# EAGLE design Single-Phase-Energy-Meter_v1.4-rev1 (EAGLE 9.4.2)
CNAME: Single Phase Energy Meter; CREVISION: 2; DESIGNER: John deGlavina
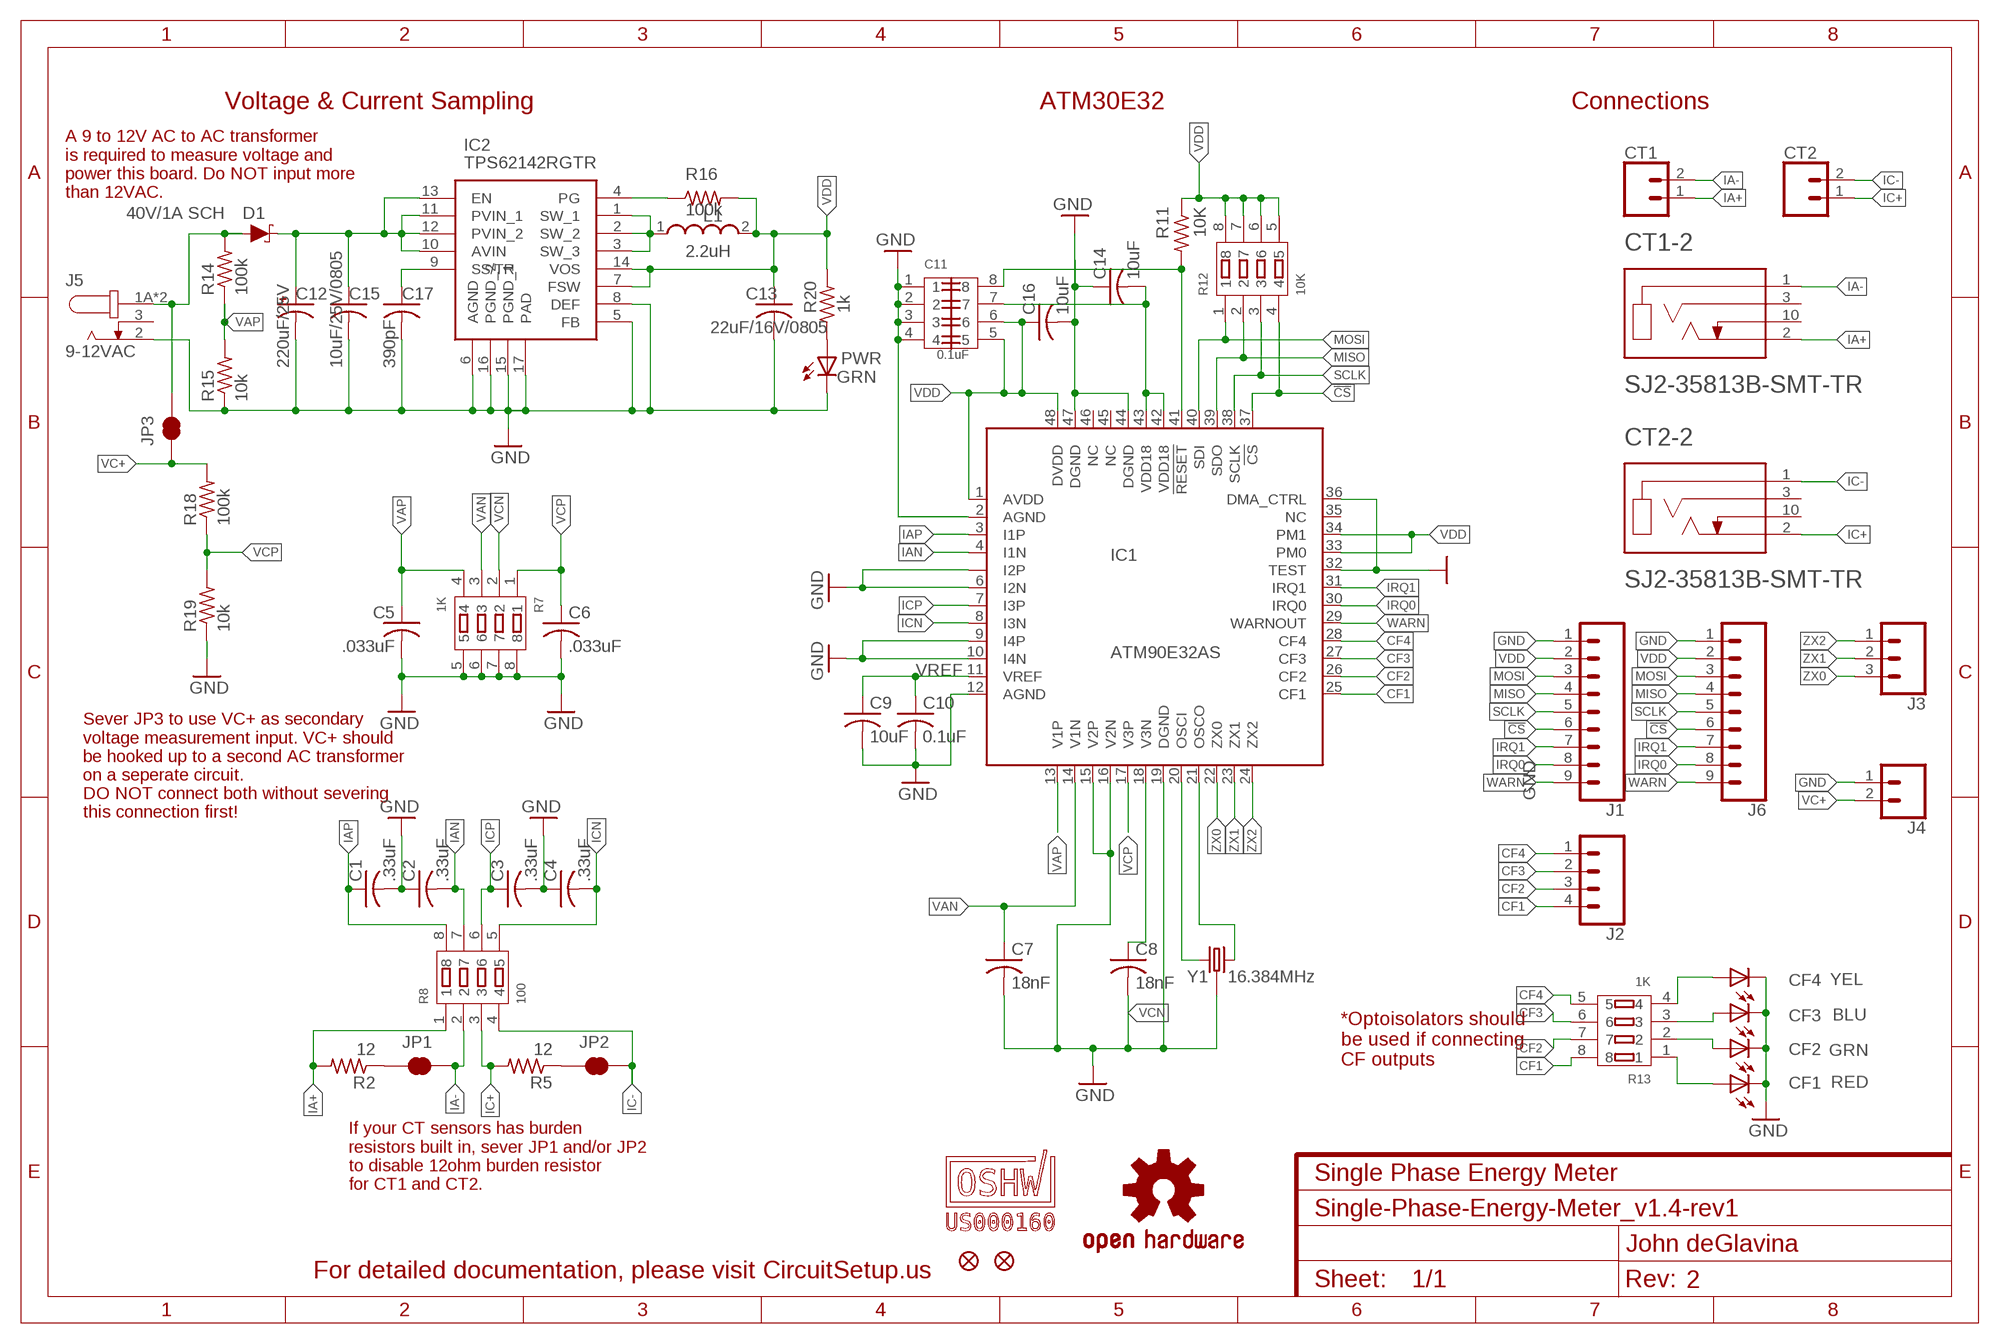
[diagram p0: schematic, sheet 1]

## Parts
C1  .33uF  C-USC0603  [C0603]
C2  .33uF  C-USC0603  [C0603]
C3  .33uF  C-USC0603  [C0603]
C4  .33uF  C-USC0603  [C0603]
C5  .033uF  C-USC0603  [C0603]
C6  .033uF  C-USC0603  [C0603]
C7  18nF  C-USC0603  [C0603]
C8  18nF  C-USC0603  [C0603]
C9  10uF  C-USC0603  [C0603]
C10  0.1uF  C-USC0603  [C0603]
C11  0.1uF  CAP-ARRAY4  [CAPCAF80P320X160X70-8]
C12  220uF/25V  CPOL-US153CLV-0605  [153CLV-0605]
C13  22uF/16V/0805  C-USC0805  [C0805]
C14  10uF  C-USC0603  [C0603]
C15  10uF/25V/0805  C-USC0805  [C0805]
C16  10uF  C-USC0603  [C0603]
C17  390pF  C-USC0603  [C0603]
CF1  RED  LEDCHIP-LED0603  [CHIP-LED0603]
CF2  GRN  LEDCHIP-LED0603  [CHIP-LED0603]
CF3  BLU  LEDCHIP-LED0603  [CHIP-LED0603]
CF4  YEL  LEDCHIP-LED0603  [CHIP-LED0603]
CT1  CONN_023.5MM  [SCREWTERMINAL-3.5MM-2]
CT1-2  SJ2-35813B-SMT-TR  [CUI_SJ2-35813B-SMT-TR]
CT2  CONN_023.5MM  [SCREWTERMINAL-3.5MM-2]
CT2-2  SJ2-35813B-SMT-TR  [CUI_SJ2-35813B-SMT-TR]
D1  40V/1A SCH  DIODE-SCHOTTKY-SS14  [SMA-DIODE]
FD1  FIDUCIALUFIDUCIAL  [FIDUCIAL-MICRO]
FD2  FIDUCIALUFIDUCIAL  [FIDUCIAL-MICRO]
IC1  ATM90E32AS  ATM90E36  [QFP50P900X900X120-48N]
IC2  TPS62142RGTR  [QFN50P300X300X100-17N]
J1  CONN_09  [1X09]
J2  CONN_04  [1X04]
J3  CONN_03  [1X03]
J4  CONN_02  [1X02]
J5  9-12VAC  PJ-002AH-SMT-TR  [CUI_PJ-002AH-SMT-TR]
J6  CONN_09  [1X09]
JP1  JUMPER-SMT_2_NC_TRACE_SILK  [SMT-JUMPER_2_NC_TRACE_SILK]
JP2  JUMPER-SMT_2_NC_TRACE_SILK  [SMT-JUMPER_2_NC_TRACE_SILK]
JP3  JUMPER-SMT_2_NC_TRACE_SILK  [SMT-JUMPER_2_NC_TRACE_SILK]
L1  2.2uH  PA4332.222NLT  [INDPM4042X200N]
LOGO1  OSHW-LOGOS  [OSHW-LOGO-S]
PWR  GRN  LEDCHIP-LED0603  [CHIP-LED0603]
R2  12  R-US_R0603  [R0603]
R5  12  R-US_R0603  [R0603]
R7  1K  SMD-RES-ARRAY-1K-4R(RA1206-8)  [RA1206-8]
R8  100  SMD-RES-ARRAY-1K-4R(RA1206-8)  [RA1206-8]
R11  10K  R-US_R0603  [R0603]
R12  10K  SMD-RES-ARRAY-1K-4R(RA1206-8)  [RA1206-8]
R13  1K  SMD-RES-ARRAY-1K-4R(RA1206-8)  [RA1206-8]
R14  100k  R-US_R0603  [R0603]
R15  10k  R-US_R0603  [R0603]
R16  100k  R-US_R0603  [R0603]
R18  100k  R-US_R0603  [R0603]
R19  10k  R-US_R0603  [R0603]
R20  1k  R-US_R0603  [R0603]
U$1  CS_OSHW_LOGOS  [OSHW160]
Y1  16.384MHz  CRYSTAL-GROUNDEDSMD-3.2X2.5  [CRYSTAL-SMD-3.2X2.5MM]

## Nets
!CS: IC1.37(!CS) J1.6 J6.6 R12.4
!RESET: C11.8 IC1.41(!RESET) R11.2
CF1: IC1.25(CF1) J2.4 R13.8
CF2: IC1.26(CF2) J2.3 R13.7
CF3: IC1.27(CF3) J2.2 R13.6
CF4: IC1.28(CF4) J2.1 R13.5
GND [pwr]: C1.2 C2.1 C3.2 C4.1 C5.2 C6.2 C7.2 C8.2 C9.2 C10.2 C11.1 C11.2 C11.3 C11.4 C12.- C13.2 C14.1 C15.2 C16.2 C17.2 CF1.C CF2.C CF3.C CF4.C IC1.2(AGND) IC1.5(I2P) IC1.6(I2N) IC1.9(I4P) IC1.10(I4N) IC1.12(AGND) IC1.15(V2P) IC1.16(V2N) IC1.19(DGND) IC1.32(TEST) IC1.36(DMA_CTRL) IC1.44(DGND) IC1.47(DGND) IC2.5(FB) IC2.6(AGND) IC2.8(DEF) IC2.15(PGND_1) IC2.16(PGND_2) IC2.17(PAD) J1.1 J4.1 J5.2 J6.1 PWR.C R7.5 R7.6 R7.7 R7.8 R15.1 R19.1 Y1.2 Y1.4
IA+ [analog]: CT1-2.2(TIP) CT1.1 R2.2 R8.1
IA- [analog]: CT1-2.1(SLEEVE) CT1.2 JP1.2 R8.2
IAN [analog]: C2.2 IC1.4(I1N) R8.7
IAP [analog]: C1.1 IC1.3(I1P) R8.8
IC+ [analog]: CT2-2.2(TIP) CT2.1 R5.2 R8.3
IC- [analog]: CT2-2.1(SLEEVE) CT2.2 JP2.2 R8.4
ICN [analog]: C4.2 IC1.8(I3N) R8.5
ICP [analog]: C3.1 IC1.7(I3P) R8.6
IRQ0: IC1.30(IRQ0) J1.8 J6.8
IRQ1: IC1.31(IRQ1) J1.7 J6.7
MISO: IC1.39(SDO) J1.4 J6.4 R12.2
MOSI: IC1.40(SDI) J1.3 J6.3 R12.1
N$1: JP1.1 R2.1
N$2: JP2.1 R5.1
N$3: CF4.A R13.4
N$4: CF3.A R13.3
N$5: CF2.A R13.2
N$6: CF1.A R13.1
N$12: PWR.A R20.1
OSCI: IC1.20(OSCI) Y1.1
OSCO: IC1.21(OSCO) Y1.3
PG: IC2.4(PG) R16.1
SCLK: IC1.38(SCLK) J1.5 J6.5 R12.3
SS/TR: C17.1 IC2.9(SS/TR)
SW: IC2.1(SW_1) IC2.2(SW_2) IC2.3(SW_3) L1.1
VA+: D1.A J5.1A J5.1B JP3.2 R14.2
VAN [analog]: C7.1 IC1.14(V1N) R7.3
VAP [analog]: C5.1 IC1.13(V1P) R7.4 R14.1 R15.2
VC+: J4.2 JP3.1 R18.2
VCN [analog]: C8.1 IC1.18(V3N) R7.2
VCP [analog]: C6.1 IC1.17(V3P) R7.1 R18.1 R19.2
VDD [pwr]: C11.5 C11.6 C13.1 C16.1 IC1.1(AVDD) IC1.33(PM0) IC1.34(PM1) IC1.48(DVDD) IC2.7(FSW) IC2.14(VOS) J1.2 J6.2 L1.2 R11.1 R12.5 R12.6 R12.7 R12.8 R16.2 R20.2
VDD18 [pwr]: C11.7 C14.2 IC1.42(VDD18) IC1.43(VDD18)
VIN1: C12.+ C15.1 D1.C IC2.10(AVIN) IC2.11(PVIN_1) IC2.12(PVIN_2) IC2.13(EN)
VREF: C9.1 C10.1 IC1.11(VREF)
WARN: IC1.29(WARNOUT) J1.9 J6.9
ZX0: IC1.22(ZX0) J3.3
ZX1: IC1.23(ZX1) J3.2
ZX2: IC1.24(ZX2) J3.1
Unconnected: CT1-2.3(RING) CT1-2.10(TIP_SWITCH) CT2-2.3(RING) CT2-2.10(TIP_SWITCH) IC1.35(NC) IC1.45(NC) IC1.46(NC) J5.3

## Notes on the sheet
- Voltage & Current Sampling | ATM30E32 | Connections
- A 9 to 12V AC to AC transformer
  is required to measure voltage and 
  power this board. Do NOT input more 
  than 12VAC.
- Sever JP3 to use VC+ as secondary 
  voltage measurement input. VC+ should
  be hooked up to a second AC transformer
  on a seperate circuit.
  DO NOT connect both without severing 
  this connection first!
- *Optoisolators should 
  be used if connecting 
  CF outputs
- If your CT sensors has burden 
  resistors built in, sever JP1 and/or JP2
  to disable 12ohm burden resistor 
  for CT1 and CT2.
- For detailed documentation, please visit CircuitSetup.us

## Library data of the parts
C1-C10 C13-C17 = rcl:C-US: CAPACITOR, American symbol; SPICEPREFIX: C
C11 = CL31B104KACNBNC:CAP-ARRAY4
C12 = rcl:CPOL-US: POLARIZED CAPACITOR, American symbol; SPICEPREFIX: C
CF1-CF4 PWR = adafruit:LED: LED OSRAM: - CHIPLED LG R971, LG N971, LY N971, LG Q971, LY Q971, LO R971, LY R971 LH N974, LH R974 LS Q976, LO Q976, LY Q976 LO Q996 - Hyper CHIPLED LW Q18S LB Q993, LB Q99A, LB R99A - SideLED LS A670, LO A670, LY A670, LG A670, LP A670 LB A673, LV A673, LT A673, LW A673 LH A674 LY A675 LS A676, LA A676, LO A676, LY A676, LW A676 LS A679, LY A679, LG A679 - Hyper Micro SIDELED® LS Y876, LA Y876, LO Y876, LY Y876 LT Y87S - SmartLED LW L88C, LW L88S LB L89C, LB L89S, LG L890 LS L89K, LO L89K, LY L89K LS L896, LA L896, LO L896, LY L896 - TOPLED LS T670, LO T670, LY T670, LG T670, LP T670 LSG T670, LSP T670, LSY T670, LOP T670, LYG T670 LG T671, LOG T671, LSG T671 LB T673, LV T673, LT T673, LW T673 LH T674 LS T676, LA T676, LO T676, LY T676, LB T676, LH T676, LSB T676, LW T676 LB T67C, LV T67C, LT T67C, LS T67K, LO T67K, LY T67K, LW E67C LS E67B, LA E67B, LO E67B, LY E67B, LB E67C, LV E67C, LT E67C LW T67C LS T679, LY T679, LG T679 LS T770, LO T770, LY T770, LG T770, LP T770 LB T773, LV T773, LT T773, LW T773 LH T774 LS E675, LA E675, LY E675, LS T675 LS T776, LA T776, LO T776, LY T776, LB T776 LHGB T686 LT T68C, LB T68C - Hyper Mini TOPLED® LB M676 - Mini TOPLED Santana® LG M470 LS M47K, LO M47K, LY M47K Source: http://www.osram.convergy.de/
CT1 CT2 = SparkFun-Connectors:CONN_02: Multi connection point. Often used as Generic Header-pin footprint for 0.1 inch spaced/style header connections On any of the 0.1 inch spaced packages, you can populate with these: Break Away Headers - Straight <https://www.sparkfun.com/products/116> (PRT-00116) Break Away Male Headers - Right Angle <https://www.sparkfun.com/products/553> (PRT-00553) Female Headers <https://www.sparkfun.com/products/115> (PRT-00115) Break Away Headers - Machine Pin <https://www.sparkfun.com/products/117> (PRT-00117) Break Away Female Headers - Swiss Machine Pin <https://www.sparkfun.com/products/743> (PRT-00743) For SCREWTERMINALS and SPRING TERMINALS visit here: Screw Terimnals on SparkFun.com <https://www.sparkfun.com/search/results?term=Screw+Terminals> (5mm/3.5mm/2.54mm spacing) This device is also useful as a general connection point to wire up your design to another part of your project. Our various solder wires solder well into these plated through hole pads. Hook-Up Wire - Assortment (Stranded, 22 AWG) <https://www.sparkfun.com/products/11375> (PRT-11375) Hook-Up Wire - Assortment (Solid Core, 22 AWG) <https://www.sparkfun.com/products/11367> (PRT-11367) View the entire wire category on our website here <https://www.sparkfun.com/categories/141> Special notes: Molex polarized connector foot print use with: PRT-08233 with associated crimp pins and housings. 2.54_SCREWTERM for use with PRT-10571. 3.5mm Screw Terminal footprints for PRT-08084 5mm Screw Terminal footprints for use with PRT-08432; PROD_ID: CONN-08399
CT1-2 CT2-2 = SJ2-35813B-SMT-TR:SJ2-35813B-SMT-TR: 3 conductors, 3.5mm, SMT Audio Jack w/ Tip Switch; MANUFACTURER: CUI; MPN: SJ2-35813B-SMT-TR; PART_REV: 1.01; STANDARD: Manufacturer recommendation
D1 = SparkFun-DiscreteSemi:DIODE-SCHOTTKY: Schottky diode A Schottky diode is a semiconductor diode which has a low forward voltage drop and a very fast switching action.; PROD_ID: DIO-08053; VALUE: 1A/40V/500mV
FD1 FD2 = SparkFun-Aesthetics:FIDUCIAL: Fiducial Alignment Points Point-of-reference for pick-and-place machines and other optical instruments.
IC1 = ATM90E36:ATM90E36: ATMEL Poly-phase energy metering; OC_FARNELL: unknown; OC_NEWARK: unknown; SPICEPREFIX: X
IC2 = SamacSys_Parts:TPS62142RGTR: TEXAS INSTRUMENTS - TPS62142RGTR - DC/DC CONV, SYNC BUCK, 2.5MHZ, VQFN-16 Source: Datasheet <http://www.ti.com/lit/ds/symlink/tps62140.pdf>; DESCRIPTION: TEXAS INSTRUMENTS - TPS62142RGTR - DC/DC CONV, SYNC BUCK, 2.5MHZ, VQFN-16; HEIGHT: 1mm; MANUFACTURER_NAME: Texas Instruments; MANUFACTURER_PART_NUMBER: TPS62142RGTR; MOUSER_PART_NUMBER: 595-TPS62142RGTR; MOUSER_PRICE-STOCK: https://www.mouser.com/Search/Refine.aspx?Keyword=595-TPS62142RGTR
J1 J6 = SparkFun-Connectors:CONN_09: Multi connection point. Often used as Generic Header-pin footprint for 0.1 inch spaced/style header connections On any of the 0.1 inch spaced packages, you can populate with these: Break Away Headers - Straight <https://www.sparkfun.com/products/116> (PRT-00116) Break Away Male Headers - Right Angle <https://www.sparkfun.com/products/553> (PRT-00553) Female Headers <https://www.sparkfun.com/products/115> (PRT-00115) Break Away Headers - Machine Pin <https://www.sparkfun.com/products/117> (PRT-00117) Break Away Female Headers - Swiss Machine Pin <https://www.sparkfun.com/products/743> (PRT-00743) For SCREWTERMINALS and SPRING TERMINALS visit here: Screw Terimnals on SparkFun.com <https://www.sparkfun.com/search/results?term=Screw+Terminals> (5mm/3.5mm/2.54mm spacing) This device is also useful as a general connection point to wire up your design to another part of your project. Our various solder wires solder well into these plated through hole pads. Hook-Up Wire - Assortment (Stranded, 22 AWG) <https://www.sparkfun.com/products/11375> (PRT-11375) Hook-Up Wire - Assortment (Solid Core, 22 AWG) <https://www.sparkfun.com/products/11367> (PRT-11367) View the entire wire category on our website here <https://www.sparkfun.com/categories/141> Special notes: Molex polarized connector foot print use with SKU : PRT-08231 with associated crimp pins and housings. 1MM SMD Version SKU: PRT-10208 NOTES ON THE VARIANTS LOCK and LOCK_LONGPADS... This footprint was designed to help hold the alignment of a through-hole component (i.e. 6-pin header) while soldering it into place. You may notice that each hole has been shifted either up or down by 0.005 of an inch from it's more standard position (which is a perfectly straight line). This slight alteration caused the pins (the squares in the middle) to touch the edges of the holes. Because they are alternating, it causes a "brace" to hold the component in place. 0.005 has proven to be the perfect amount of "off-center" position when using our standard breakaway headers. Although looks a little odd when you look at the bare footprint, once you have a header in there, the alteration is very hard to notice. Also,if you push a header all the way into place, it is covered up entirely on the bottom side.
J2 = SparkFun-Connectors:CONN_04: Multi connection point. Often used as Generic Header-pin footprint for 0.1 inch spaced/style header connections On any of the 0.1 inch spaced packages, you can populate with these: Break Away Headers - Straight <https://www.sparkfun.com/products/116> (PRT-00116) Break Away Male Headers - Right Angle <https://www.sparkfun.com/products/553> (PRT-00553) Female Headers <https://www.sparkfun.com/products/115> (PRT-00115) Break Away Headers - Machine Pin <https://www.sparkfun.com/products/117> (PRT-00117) Break Away Female Headers - Swiss Machine Pin <https://www.sparkfun.com/products/743> (PRT-00743) For SCREWTERMINALS and SPRING TERMINALS visit here: Screw Terimnals on SparkFun.com <https://www.sparkfun.com/search/results?term=Screw+Terminals> (5mm/3.5mm/2.54mm spacing) This device is also useful as a general connection point to wire up your design to another part of your project. Our various solder wires solder well into these plated through hole pads. Hook-Up Wire - Assortment (Stranded, 22 AWG) <https://www.sparkfun.com/products/11375> (PRT-11375) Hook-Up Wire - Assortment (Solid Core, 22 AWG) <https://www.sparkfun.com/products/11367> (PRT-11367) View the entire wire category on our website here <https://www.sparkfun.com/categories/141> Special notes: Molex polarized connector foot print use with SKU : PRT-08231 with associated crimp pins and housings. 1MM SMD Version SKU: PRT-10208; PROD_ID: CONN-09696
J3 = SparkFun-Connectors:CONN_03: Multi connection point. Often used as Generic Header-pin footprint for 0.1 inch spaced/style header connections On any of the 0.1 inch spaced packages, you can populate with these: Break Away Headers - Straight <https://www.sparkfun.com/products/116> (PRT-00116) Break Away Male Headers - Right Angle <https://www.sparkfun.com/products/553> (PRT-00553) Female Headers <https://www.sparkfun.com/products/115> (PRT-00115) Break Away Headers - Machine Pin <https://www.sparkfun.com/products/117> (PRT-00117) Break Away Female Headers - Swiss Machine Pin <https://www.sparkfun.com/products/743> (PRT-00743) Stackable Header - 3 Pin (Female, 0.1") <https://www.sparkfun.com/products/13875> (PRT-13875) For SCREWTERMINALS and SPRING TERMINALS visit here: Screw Terimnals on SparkFun.com <https://www.sparkfun.com/search/results?term=Screw+Terminals> (5mm/3.5mm/2.54mm spacing) This device is also useful as a general connection point to wire up your design to another part of your project. Our various solder wires solder well into these plated through hole pads. Hook-Up Wire - Assortment (Stranded, 22 AWG) <https://www.sparkfun.com/products/11375> (PRT-11375) Hook-Up Wire - Assortment (Solid Core, 22 AWG) <https://www.sparkfun.com/products/11367> (PRT-11367) View the entire wire category on our website here <https://www.sparkfun.com/categories/141> Special notes: Molex polarized connector foot print use with SKU : PRT-08232 with associated crimp pins and housings.
J4 = SparkFun-Connectors:CONN_02: Multi connection point. Often used as Generic Header-pin footprint for 0.1 inch spaced/style header connections On any of the 0.1 inch spaced packages, you can populate with these: Break Away Headers - Straight <https://www.sparkfun.com/products/116> (PRT-00116) Break Away Male Headers - Right Angle <https://www.sparkfun.com/products/553> (PRT-00553) Female Headers <https://www.sparkfun.com/products/115> (PRT-00115) Break Away Headers - Machine Pin <https://www.sparkfun.com/products/117> (PRT-00117) Break Away Female Headers - Swiss Machine Pin <https://www.sparkfun.com/products/743> (PRT-00743) For SCREWTERMINALS and SPRING TERMINALS visit here: Screw Terimnals on SparkFun.com <https://www.sparkfun.com/search/results?term=Screw+Terminals> (5mm/3.5mm/2.54mm spacing) This device is also useful as a general connection point to wire up your design to another part of your project. Our various solder wires solder well into these plated through hole pads. Hook-Up Wire - Assortment (Stranded, 22 AWG) <https://www.sparkfun.com/products/11375> (PRT-11375) Hook-Up Wire - Assortment (Solid Core, 22 AWG) <https://www.sparkfun.com/products/11367> (PRT-11367) View the entire wire category on our website here <https://www.sparkfun.com/categories/141> Special notes: Molex polarized connector foot print use with: PRT-08233 with associated crimp pins and housings. 2.54_SCREWTERM for use with PRT-10571. 3.5mm Screw Terminal footprints for PRT-08084 5mm Screw Terminal footprints for use with PRT-08432
J5 = PJ-002AH-SMT-TR:PJ-002AH-SMT-TR: 2.0 mm Center Pin, 5.0 A, Right Angle, Surface Mount (SMT), Dc Power Jack Connector; AVAILABILITY: Good; DESCRIPTION: 24 VDC 5 A Surface Mount Unshielded 2 Conductors 3 Contacts Male Power Jack; MF: CUI; MP: PJ-002AH-SMT-TR; PACKAGE: None; PRICE: 0.88 USD
JP1-JP3 = SparkFun-Jumpers:JUMPER-SMT_2_NC_TRACE: Normally closed trace jumper This jumper has a trace between two pads so it's normally closed (NC). Use a razor knife to open the connection. For best results follow the IPC guidelines for cutting traces: Cutout at least 0.063 mm (0.005 in). Remove all loose material to clean up the cut area. Seal the cut with an approved epoxy. Reapply solder to reclose the connection.
L1 = PA4332.222NLT:PA4332.222NLT: Inductor Power Shielded Drum Core 2.2uH 20% 1MHz 4.3A 48mOhm DCR 1515 T/R Source: Datasheet <http://productfinder.pulseeng.com/products/datasheets/P761.pdf>; ARROW_PART_NUMBER: PA4332.222NLT; ARROW_PRICE-STOCK: https://www.arrow.com/en/products/pa4332.222nlt/pulse-electronics-corporation; DESCRIPTION: Inductor Power Shielded Drum Core 2.2uH 20% 1MHz 4.3A 48mOhm DCR 1515 T/R; HEIGHT: 2mm; MANUFACTURER_NAME: Pulse; MANUFACTURER_PART_NUMBER: PA4332.222NLT
LOGO1 = SparkFun-Aesthetics:OSHW-LOGO: Open-Source Hardware (OSHW) Logo This logo indicates the piece of hardware it is found on incorporates a OSHW license and/or adheres to the definition of open source hardware found here: http://freedomdefined.org/OSHW
R2 R5 R11 R14-R16 R18-R20 = rcl:R-US_: RESISTOR, American symbol; SPICEPREFIX: R
R7 R13 = Seeed-Resistor-2016:SMD-RES-ARRAY-1K-4R(RA1206-8): 301030012; MPN: Chip-Array-Series-1%
R8 R12 = Seeed-Resistor-2016:SMD-RES-ARRAY-1K-4R(RA1206-8): 301030012; MPN: Chip-Array-Series-1%; VALUE: 1K
U$1 = circuitsetup_logos:CS_OSHW_LOGOS
Y1 = SparkFun-Clocks:CRYSTAL-GROUNDED: Crystals w/ Ground Pin (Generic) These are passive quartz crystals, which can be used as a clock source for a microcontroller. Crystal's are usually two-terminal devices. A third terminal may be optionally connected to ground, as recommended by the manufaturer.

## Net classes
0 default: width 0.152 mm, drill 0.33 mm, clearance 0.152 mm
1 pwr: width 0.305 mm, drill 0.356 mm, clearance 0.152 mm
2 analog: width 0.305 mm, drill 0.33 mm, clearance 0.152 mm

## Board
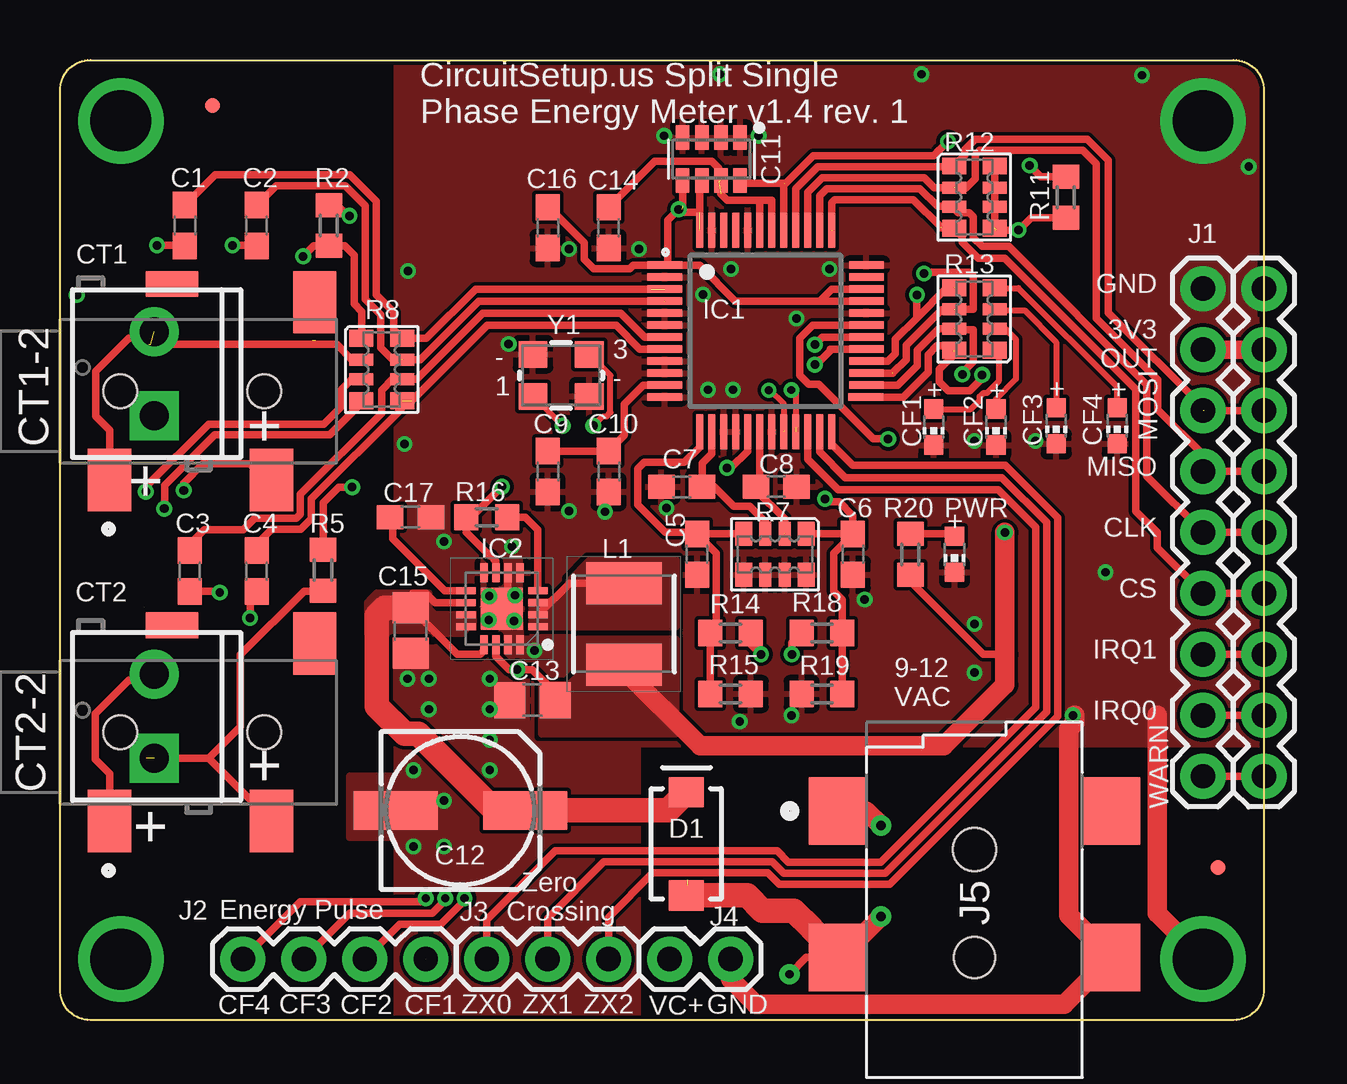
[diagram p1: board, top side]
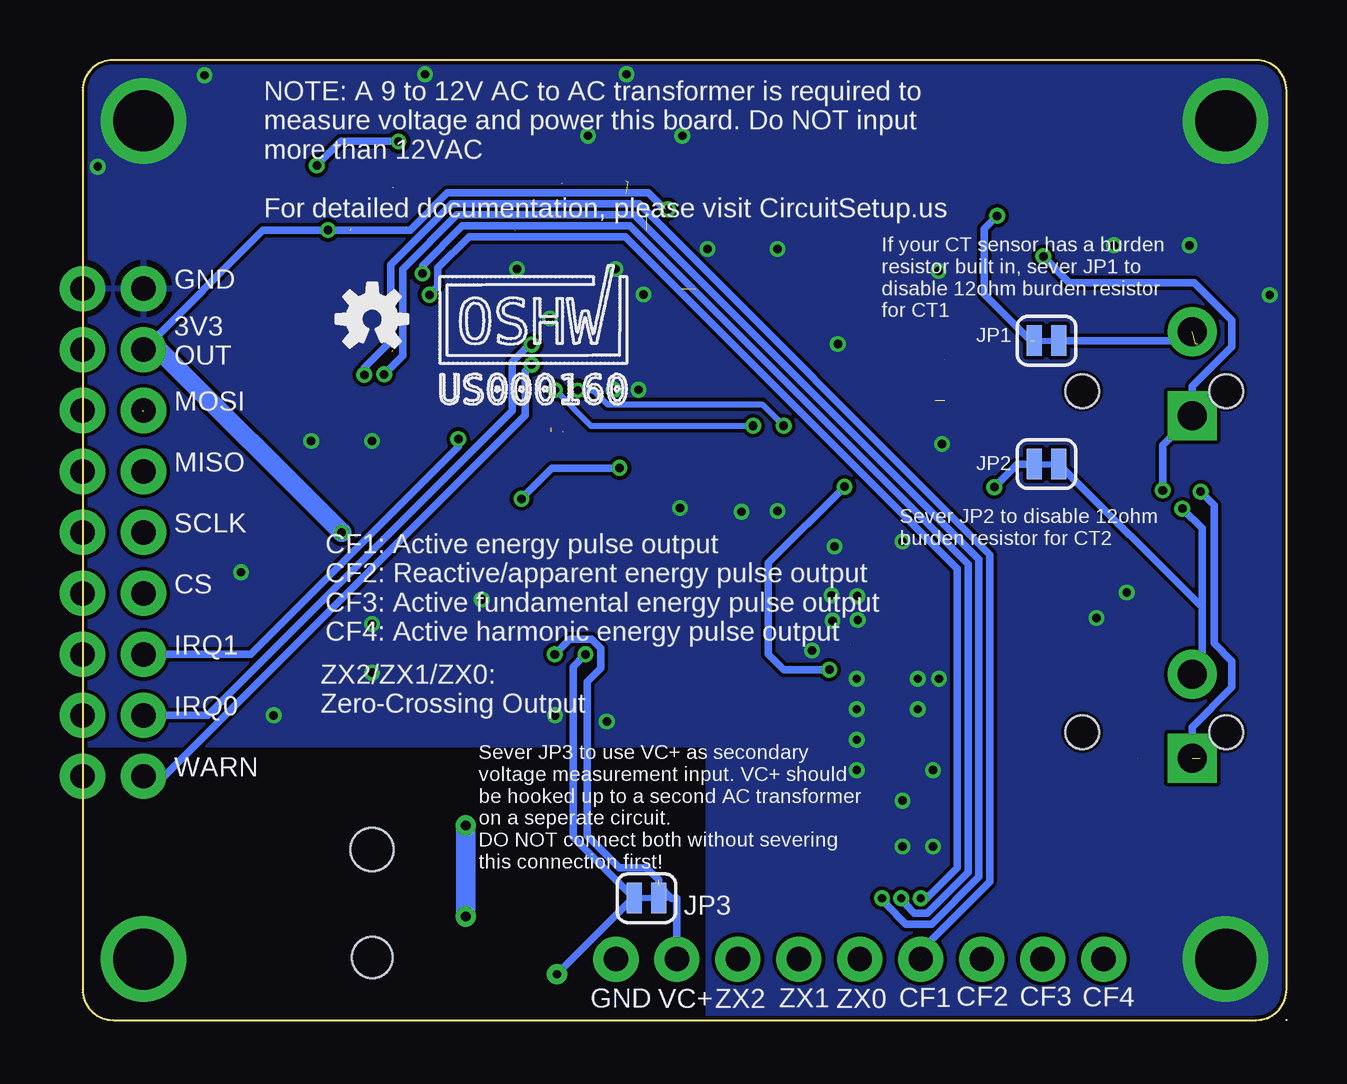
[diagram p2: board, bottom side, seen from below]

Size 50.16 x 40.01 mm. Coordinates in mm from the lower left corner, seen from the top.
Outline: 50.16,38.73 50.16,1.27 arc-90 48.9,0 1.27,0 arc-90 0,1.27 0,38.73 arc-90 1.27,40.01 48.9,40.01 arc-90 50.16,38.73
Copper layers (1*16): Top 0.035mm / dielectric 1.5mm / Bottom 0.035mm
Design rules "hackvana *": minimum track width 6mil, minimum drill 0.3mm, track to track 6mil, track to pad 6mil, pad to pad 6mil, via to via 6mil, smd to smd 0mil, copper to edge 6mil, drill to drill 6mil, minimum pad ring 10mil, minimum via ring 6mil, stop-mask expansion 4mil, vias tented up to drill 25mil, thermal gap 10mil

### Footprints (pad centres in the part's own frame; a part is rotated, then mirrored left to right if it is on the bottom)
C0603 = smd 1.1 x 1: 1 -0.85,0; 2 0.85,0
CAPCAF80P320X160X70-8 = smd 1.014 x 0.564: 1 -0.895,1.2; 2 -0.895,0.4; 3 -0.895,-0.4; 4 -0.895,-1.2; 5 0.895,-1.2; 6 0.895,-0.4; 7 0.895,0.4; 8 0.895,1.2
153CLV-0605 = smd 3.5 x 1.6: + 2.7,0; - -2.7,0
C0805 = smd 1.3 x 1.5: 1 -0.95,0; 2 0.95,0
CHIP-LED0603 = smd 0.8 x 0.8: A 0,-0.75; C 0,0.75
SCREWTERMINAL-3.5MM-2 = drill 1.2 pad 2.032 square: 1 0,0 | drill 1.2 pad 2.032: 2 3.5,0
CUI_SJ2-35813B-SMT-TR = smd 1.8 x 2.6: 1 -3.7,-3.7; 2 3.05,-3.7; 10 4.85,3.7 | smd 2.184 x 1.067: 3 -1.1,4.462 | hole 1.4: -3.25,0; 2.75,0
SMA-DIODE = smd 1.27 x 1.47: A -2.15,0; C 2.15,0
FIDUCIAL-MICRO = smd 0.635 x 0.635: 1 0,0
QFP50P900X900X120-48N = smd 1.45 x 0.3: 1 -4.2,2.75; 2 -4.2,2.25; 3 -4.2,1.75; 4 -4.2,1.25; 5 -4.2,0.75; 6 -4.2,0.25; 7 -4.2,-0.25; 8 -4.2,-0.75; 9 -4.2,-1.25; 10 -4.2,-1.75; 11 -4.2,-2.25; 12 -4.2,-2.75; 25 4.17,-2.75; 26 4.2,-2.25; 27 4.2,-1.75; 28 4.2,-1.25; 29 4.2,-0.75; 30 4.2,-0.25; 31 4.2,0.25; 32 4.2,0.75; 33 4.2,1.25; 34 4.2,1.75; 35 4.2,2.25; 36 4.2,2.75 | smd 0.3 x 1.45: 13 -2.75,-4.2; 14 -2.25,-4.2; 15 -1.75,-4.2; 16 -1.25,-4.2; 17 -0.75,-4.2; 18 -0.25,-4.2; 19 0.25,-4.2; 20 0.75,-4.2; 21 1.25,-4.2; 22 1.75,-4.2; 23 2.25,-4.2; 24 2.75,-4.2; 37 2.75,4.2; 38 2.25,4.2; 39 1.75,4.2; 40 1.25,4.2; 41 0.75,4.2; 42 0.25,4.2; 43 -0.25,4.2; 44 -0.75,4.2; 45 -1.25,4.2; 46 -1.75,4.2; 47 -2.25,4.2; 48 -2.75,4.2
QFN50P300X300X100-17N = smd 0.8 x 0.3: 1 -1.5,0.75; 2 -1.5,0.25; 3 -1.5,-0.25; 4 -1.5,-0.75; 9 1.5,-0.75; 10 1.5,-0.25; 11 1.5,0.25; 12 1.5,0.75 | smd 0.3 x 0.8: 5 -0.75,-1.5; 6 -0.25,-1.5; 7 0.25,-1.5; 8 0.75,-1.5; 13 0.75,1.5; 14 0.25,1.5; 15 -0.25,1.5; 16 -0.75,1.5 | smd 1.75 x 1.75: 17 0,0
1X09 = drill 1.016 pad 1.88: 1 0,0; 2 2.54,0; 3 5.08,0; 4 7.62,0; 5 10.16,0; 6 12.7,0; 7 15.24,0; 8 17.78,0; 9 20.32,0
1X04 = drill 1.016 pad 1.88: 1 0,0; 2 2.54,0; 3 5.08,0; 4 7.62,0
1X03 = drill 1.016 pad 1.88: 1 0,0; 2 2.54,0; 3 5.08,0
1X02 = drill 1.016 pad 1.88: 1 0,0; 2 2.54,0
CUI_PJ-002AH-SMT-TR = smd 2.8 x 2.4: 1A 0,0; 1B -6.1,0; 2 -6.1,-11.4; 3 0,-11.4 | hole 1.7: -6.1,-5.7 | hole 1.8: -1.6,-5.7
SMT-JUMPER_2_NC_TRACE_SILK = smd 0.635 x 1.27: 1 -0.508,0; 2 0.508,0
INDPM4042X200N = smd 1.75 x 3.15: 1 -1.7,0; 2 1.7,0
R0603 = smd 1 x 1.1: 1 -0.85,0; 2 0.85,0
RA1206-8 = smd 0.7 x 1: 1 -1.3,-0.85; 4 1.3,-0.85; 5 1.3,0.85; 8 -1.3,0.85 | smd 0.5 x 1: 2 -0.4,-0.85; 3 0.4,-0.85; 6 0.4,0.85; 7 -0.4,0.85
CRYSTAL-SMD-3.2X2.5MM = smd 1.2 x 1.1: 1 -1.175,-0.875; 2 1.175,-0.875; 3 1.175,0.875; 4 -1.175,0.875

### Placement (x,y rotation side)
C1  5.2,33.11 270 top
C2  8.2,33.11 90 top
C3  5.4,18.71 270 top
C4  8.2,18.71 90 top
C5  26.54,19.41 270 top
C6  33.04,19.41 270 top
C7  25.91,22.23 180 top
C8  29.84,22.23 0 top
C9  20.32,22.86 270 top
C10  22.86,22.86 270 top
C11  27.14,35.87 270 top
C12  16.69,8.74 0 top
C13  19.68,13.34 180 top
C14  22.86,33.02 90 top
C15  14.61,16.23 270 top
C16  20.32,33.02 270 top
C17  14.61,20.95 0 top
CF1  36.4,24.71 180 top
CF2  39,24.71 180 top
CF3  41.51,24.77 180 top
CF4  44.05,24.77 180 top
CT1  3.93,25.19 90 top
CT1-2  5.77,26.21 0 top
CT2  3.93,10.91 90 top
CT2-2  5.77,11.99 0 top
D1  26.09,7.34 90 top
FD1  6.35,38.1 0 top
FD2  48.26,6.35 0 top
IC1  29.4,28.71 0 top
IC2  18.41,17.14 180 top
J1  47.62,30.48 270 top
J2  7.62,2.54 0 top
J3  22.86,2.54 180 top
J4  27.94,2.54 180 top
J5  32.4,8.71 90 top
J6  50.16,30.48 270 top
JP1  10,28.31 0 bottom
JP2  10,23.17 0 bottom
JP3  26.67,5.08 180 bottom
L1  23.5,16.51 270 top
LOGO1  38.1,29.21 0 bottom
PWR  37.27,19.41 180 top
R2  11.2,33.11 270 top
R5  10.96,18.75 270 top
R7  29.79,19.41 180 top
R8  13.4,27.11 270 top
R11  41.91,34.29 90 top
R12  38.1,34.29 270 top
R13  38.1,29.21 90 top
R14  27.94,16.13 0 top
R15  27.94,13.59 180 top
R16  17.78,20.95 180 top
R18  31.75,16.13 180 top
R19  31.75,13.59 0 top
R20  35.44,19.41 270 top
U$1  36.2,24.77 0 bottom
Y1  20.88,26.86 0 top

### Tracks (layer width: path | path; a pad name or v marks a point on that pad's centre or on a via)
!CS  (2 unrouted)
  Top 0.305: 36.7,33.05 35.56,34.19 32.28,34.19 32.16,34.06 IC1.37 | 36.7,33.02 37.22,33.02 R12.4 37.6,32.64 37.6,32.41 38.26,31.75 39.36,31.75 44.83,26.28 44.83,21.21 45.72,20.32 45.72,19.68 J1.6 J6.6
!RESET  (via drill 0.36)  (1 unrouted)
  Top 0.305: IC1.41 30.15,34.87 28.45,34.87 C11.8 | 30.22,34.85 31.39,36.02 36.41,36.02 36.45,36.05 36.45,36.07 36.62,36.24 36.63,36.24 v37,36.61 | v40.4,35.61 40.87,35.14 R11.2
  Bottom 0.305: v37,36.61 39.4,36.61 v40.4,35.61
CF1  (via drill 0.36)  (3 unrouted)
  Top 0.152: R13.8 37.26,27.73
  Top 0.305: 37.26,27.73 36.65,27.13 36.65,26.6 37.02,26.23 37.9,26.23 38.42,26.75 v38.42,26.89 | IC1.25 35.13,25.96 36.17,27 36.17,27.73 36.54,28.09 37.01,28.09 37.26,27.84
  Bottom 0.305: v38.42,26.89 38.42,27.18 37.32,28.29 37.32,31.47 34.77,34.01 26.98,34.01 12.36,19.39 12.36,5.78 15.24,2.89 J2.4
CF2  (via drill 0.35, 0.36)  (1 unrouted)
  Top 0.152: 37.32,28.77 R13.7
  Top 0.305: 37.32,28.77 38.05,28.77 38.05,27.43 37.6,26.98 v37.6,26.91 | IC1.26 34.9,26.46 35.71,27.27 35.71,27.91 36.61,28.81 R13.7 | J2.3 14.15,3.99 15.86,3.99 16.86,4.99 v16.86,5.08
  Bottom 0.305: v37.6,26.91 36.83,27.68 36.83,31.29 34.57,33.55 27.17,33.55 12.81,19.2 12.81,5.96 14.79,3.99 15.86,3.99 16.68,4.82 16.68,4.91 v16.86,5.08
CF3  (via drill 0.35, 0.36)  (2 unrouted)
  Top 0.152: 36.74,29.6 36.88,29.59 37.11,29.6 R13.6
  Top 0.305: 34.7,26.96 35.26,27.52 35.26,27.94 35.26,28.13 36.74,29.6 | v36,31.11 36.05,31.16 37.88,31.16 38.05,30.99 38.05,29.61 R13.6 | 34.69,26.96 IC1.27 | 16.05,5.03 v16.05,5.08 16.05,5 15.5,4.45 12.07,4.45 J2.2
  Bottom 0.305: v36,31.11 36,31.44 34.35,33.1 27.37,33.1 13.27,19 13.27,6.15 14.98,4.45 15.5,4.45 15.87,4.82 15.87,4.9 v16.05,5.08
CF4  (via drill 0.35, 0.36)  (1 unrouted)
  Top 0.152: R13.5 37.19,30.5 37.03,30.51 36.95,30.51
  Top 0.305: 35.69,29.25 34.8,28.36 34.8,27.77 34.49,27.46 IC1.28 | 35.69,29.25 36.95,30.51 | v35.71,30.22 35.69,30.2 35.69,29.25 | J2.1 10.01,4.93 15.09,4.93 v15.24,5.08
  Bottom 0.305: v35.71,30.22 35.36,30.58 35.36,31.34 34.05,32.64 33.3,32.64 27.56,32.64 13.73,18.81 13.73,6.35 | 13.73,6.35 13.73,6.34 | 13.73,6.35 15,5.08 v15.24,5.08
GND  (via drill 0.35, 0.36, 2.54)
  Top 0.305: IC2.6 18.66,17.39 IC2.17 | v4.04,32.28 5.18,32.28 C1.2 | v7.19,32.28 8.18,32.28 C2.1 | C3.2 6.62,17.86 v6.66,17.82 | C4.1 7.92,17.58 v7.92,16.76
  Top 0.813: J4.1 27.94,1.71 29,0.65 41.84,0.65 J5.2 42.04,4.37 42.04,12.13 42.28,12.37 42.28,12.7 | v47.62,2.54 45.72,4.45 45.72,12.7
  other vias: 22.71,21.18 30.48,12.7 40.64,24.13 27,26.26 33.53,17.53 27.96,31.29 32.06,31.29 30.69,29.24 14.5,31.21 14.35,24 15.37,12.95 18.69,28.17 38.1,24.13 28.04,26.26 26.8,30.23 0.7,30.21 27.5,39.41 35.9,39.41 45.09,39.37 49.53,35.56 18.92,16.64 18.96,17.7 17.86,16.67 17.88,17.66 2.54,37.47 47.62,37.47 2.54,2.54 43.57,18.66 21.21,21.21 38.1,16.51 25.17,36.85 29.11,36.85 25.27,21.34 24.13,32.13 21.21,32.13 15.37,14.22 14.48,14.22 16,19.94 19.77,15.4 17.91,12.95 17.91,14.22 16,9.14 14.73,7.24 14.73,10.41 16,7.24 18.84,19.73 42.2,12.7 17.91,11.68 17.91,10.41 28.32,12.45 38.1,14.48
  pour Top (no thermals): 13.84,15.49 19.43,15.49 19.43,12.45 13.84,12.45
  pour Top (no thermals): 13.97,15.11 13.97,14.61 14.61,14.61 14.61,15.11
  pour Top (no thermals): 19.18,16.51 18.67,16.51 18.67,14.86 19.3,14.86 20.07,15.62 20.07,15.88 19.3,15.88 19.18,16
  pour Top (no thermals): 12.06,10.16 16.51,10.16 16.51,7.62 12.06,7.62
  pour Top (no thermals): 14.61,21.84 14.61,20.45 16.13,18.92 16.13,21.84
  pour Top (no thermals): 18.54,20.07 19.18,20.07 19.18,17.53 18.54,17.53
  pour Top (no thermals): 46.1,31.75 49.78,31.75 49.78,29.21 46.1,29.21
  pour Top (rank 2): 13.97,40.64 50.8,40.64 50.8,11.43 24.13,11.43 24.13,-1.27 13.97,-1.27
  pour Bottom: -1.27,40.64 50.8,40.64 50.8,11.43 24.13,11.43 24.13,-1.27 -1.27,-1.27
IA+  (via drill 0.36)
  Top 0.305: v10.13,31.83 10.57,32.26 R2.2 11.86,32.26 12.25,31.87 12.25,29.84 12.57,29.52 12.57,28.43 R8.1 | v5.16,22.07 5.16,22.38 5.95,23.17 7.9,23.17 8.56,22.51 CT1-2.2
  Bottom 0.305: v5.16,22.07 5.16,23.96 CT1.1 3.93,26.41 2.28,28.06 2.28,29.16 3.84,30.72 9.04,30.72 9.04,30.73 v10.13,31.83
IA-  (2 unrouted)
  Top 0.305: CT1-2.1 2.07,24.58 1.49,25.16 1.49,27.04 2.87,28.42 3.44,28.42 3.7,28.16 | 3.78,28.16 11.52,28.16 12.18,27.5 R8.2
  Bottom 0.305: CT1.2 4.31,28.31 JP1.2
IAN  (2 unrouted)
  Top 0.305: IC1.4 17.45,29.96 15.01,27.51 R8.7 13.87,27.51 13.37,28.01 13.37,29.38 12.71,30.04 12.71,33.93 11.88,34.77 9.01,34.77 C2.2 8.2,33.74
IAP  (1 unrouted)
  Top 0.305: 24.64,30.46 23.37,30.46 17.31,30.46 15.26,28.41 R8.8 13.9,28.76 13.9,29.5 13.17,30.23 13.17,34.12 12.07,35.22 6.46,35.22 C1.1
IC+  (via drill 0.36)  (2 unrouted)
  Top 0.305: 6.2,10.91 CT2-2.2 8.84,8.31 | 6.2,10.91 3.6,10.91 | v3.58,22.02 3.58,22.22 6.19,24.84 11,24.84 11.74,25.59 11.74,26.29 12.18,26.72 R8.3 | R5.2 10.94,17.88 10.17,17.88 7.51,15.21 7.51,12.23 6.2,10.91
  Bottom 0.305: CT2.1 3.93,12.21 2.28,13.86 2.28,14.96 3.02,15.69 3.02,21.46 v3.58,22.02
IC-  (via drill 0.36)  (1 unrouted)
  Top 0.305: R8.4 12.6,25.76 12.6,25.74 11.24,24.38 6.45,24.38 4.36,22.29 4.36,21.33 v4.34,21.31 | CT2-2.1 2.07,10.26 1.46,10.86 1.46,12.76 2.86,14.16 3.93,14.16 CT2.2
  Bottom 0.305: JP2.2 3.52,17.2 | CT2.2 3.52,14.82 3.52,17.2 | v4.34,21.31 3.52,20.48 3.52,17.2
ICN  (1 unrouted)
  Top 0.305: 14.65,25.81 17.8,28.95 23.18,28.95 24.17,27.96 IC1.8 | 14.25,25.76 R8.5 14.22,25.78 14.22,25.46 10.48,21.72 10.48,20.9 10.03,20.45 8.81,20.45 8.32,19.95 8.32,19.56 C4.2
ICP
  Top 0.305: IC1.7 24.36,28.46 23.36,29.46 17.61,29.46 14.86,26.71 R8.6 14.23,26.69 13.85,26.69 13.41,26.25 13.41,25.29 10.02,21.91 10.02,21.09 9.84,20.91 8.11,20.91 7.64,20.43 6,20.43 5.4,19.83 C3.1
IRQ0  (via drill 0.36)
  Top 0.305: IC1.30 31.77,28.46 v31.45,28.14 | J6.8 J1.8
  Bottom 0.305: v31.45,28.14 31.55,28.14 32.27,27.43 32.27,25.39 44.96,12.7 J1.8
IRQ1  (via drill 0.36)
  Top 0.305: IC1.31 31.37,28.96 30.82,28.41 30.82,26.87 31.2,26.49 31.62,26.49 33.89,24.22 v34.51,24.22 | J6.7 J1.7
  Bottom 0.305: v34.51,24.22 34.51,23.89 43.16,15.24 J1.7
MISO  (1 unrouted)
  Top 0.152: 36.89,34.69 37.03,34.69 37.11,34.7 R12.2
  Top 0.305: R12.2 37.77,34.69 38.15,35.07 38.15,36.07 38.32,36.24 42.62,36.24 43.18,35.68 43.18,29.24 45.74,26.67 45.74,25.43 47.62,23.55 J1.4 49.53,22.86 49.82,22.86 J6.4 | 36.89,34.69 36.43,34.69 36.02,35.1 31.76,35.1 31.15,34.49 IC1.39
MOSI  (1 unrouted)
  Top 0.305: IC1.40 30.65,34.63 31.57,35.56 37.22,35.56 R12.1 37.69,36.03 37.69,36.26 38.13,36.7 42.81,36.7 43.69,35.82 43.69,29.48 47.68,25.49 47.68,25.4 | J1.3 49.53,25.4 49.82,25.4 J6.3
N$1  (via drill 0.36)  (1 unrouted)
  Top 0.305: R2.1 11.55,33.96 12,33.51 v12.06,33.51
  Bottom 0.305: 10.66,28.31 12.59,30.24 12.59,32.98 v12.06,33.51
N$2  (via drill 0.36)
  Top 0.305: v12.18,22.21 11.62,22.21 10.96,21.55 10.96,19.87 11.21,19.62 11.2,19.6 R5.1
  Bottom 0.305: JP2.1 11.21,23.17 v12.18,22.21
N$3
  Top 0.203: R13.4 38.97,30.5
  Top 0.254: 38.97,30.5 39.94,30.5 44.05,26.38 CF4.A
N$4
  Top 0.203: R13.3 38.99,29.57
  Top 0.254: 38.99,29.57 40.19,29.57 41.51,28.25 CF3.A
N$5
  Top 0.203: 39.43,28.77 38.99,28.77 R13.2
  Top 0.254: 39.43,28.77 39.83,28.36 39.83,26.71 39,25.88 CF2.A
N$6
  Top 0.203: R13.1 39.13,27.73
  Top 0.254: 39.13,27.73 39.13,26.64 38.63,26.14 38.48,26.14 38.32,25.98 38.32,25.83 37.95,25.46 CF1.A
N$12
  Top 0.305: R20.1 37.17,20.26 PWR.A
OSCI  (via drill 0.33, 0.36)  (1 unrouted)
  Top 0.152: 30.18,24.55 30.18,24.56
  Top 0.254: 29.53,26.3 30.18,25.66 30.18,24.56 | v29.53,26.25 29.53,26.3 | 29.53,26.3 | v20.95,24.77 19.73,25.99 Y1.1
  Bottom 0.2: v29.53,26.25 29.61,26.17
  Bottom 0.254: v20.95,24.77 21.85,25.66 28.29,25.66 28.89,26.25 v29.53,26.25
OSCO  (via drill 0.33, 0.36)  (1 unrouted)
  Top 0.254: v30.48,26.26 30.66,26.07 30.66,24.67 | v22.23,24.77 22.62,25.16 22.77,25.16 22.93,25.32 22.93,26.86 Y1.3
  Bottom 0.254: v30.48,26.26 28.98,24.77 v22.23,24.77
PG
  Top 0.305: IC2.4 19.91,20.43 19.39,20.95 R16.1
SCLK
  Top 0.305: IC1.38 31.65,34.34 31.95,34.65 35.83,34.65 36.56,33.91 37.23,33.91 R12.3 37.24,33.83 37.42,33.65 37.88,33.65 38.05,33.47 38.05,32.6 38.42,32.23 39.54,32.23 45.29,26.48 45.29,22.66 J1.5 49.53,20.32 49.82,20.32 J6.5
SS/TR
  Top 0.305: IC2.9 16.03,17.89 13.86,20.07 13.86,20.86 C17.1
SW
  Top 0.305: IC2.2 21.23,18.21 L1.1
  pour Top (no thermals): 19.68,17.53 20.95,17.53 21.21,17.78 21.21,18.29 22.1,19.18 25.65,19.18 25.65,16.38 19.68,16.38
VA+  (via drill 0.35 pad 0.85, 0.36, 0.4 pad 0.85)
  Top 0.305: J5.1B 31.1,2.61 v30.4,1.91 | v29.21,15.24 28.79,15.66 R14.2
  Top 0.813: J5.1A 33.6,8.71 v34.2,8.11 | v34.2,4.31 32.5,2.61 J5.1B
  Top 1.016: 32.5,2.61 31.31,3.8 31.31,3.83 30.58,4.56 29.27,4.56 28.64,5.2 D1.A
  Bottom 0.305: v30.4,1.91 27.23,5.08 JP3.2 29.72,7.62 29.72,14.73 v29.21,15.24
  Bottom 0.813: v34.2,8.11 v34.2,4.31
VAN
  Top 0.305: IC1.14 27.15,23.59 26.76,23.2 C7.1 27.26,22.23 28.07,21.42 28.74,21.42 29.4,20.75 R7.3
VAP
  Top 0.305: R15.2 R14.1 27.34,16.38 27.34,17.88 27.35,17.88 27.35,19.45 C5.1 | C5.1 R7.4 | C5.1 26.48,20.32 25.23,20.32 24.08,21.47 24.08,22.98 24.34,23.24 26.02,23.24 26.65,23.88 IC1.13
VC+  (via drill 0.36)  (1 unrouted)
  Top 0.305: v30.49,15.24 30.49,15.72 R18.2
  Bottom 0.305: 26.16,5.61 25.63,5.08 25.4,5.08 J4.2 | 25.91,5.08 JP3.1 26.16,5.84 26.67,6.35 27.8,6.35 29.14,7.69 29.14,14.09 28.57,14.66 28.57,15.5 28.95,15.88 29.86,15.88 v30.49,15.24
VCN  (1 unrouted)
  Top 0.305: IC1.18 29.15,22.48 28.85,22.18 28.85,22.23 C8.1 29,22.09 30.2,20.88 30.2,20.26
VCP  (via drill 0.36)
  Top 0.305: R7.1 C6.1 | C6.1 33.04,21.02 32.47,21.59 32,21.59 v31.88,21.72 | v27.79,23.01 27.95,23.01 28.65,23.7 IC1.17 | R19.2 R18.1 32.6,17.52 32.24,17.88 32.24,19.45 C6.1
  Bottom 0.305: v31.88,21.72 30.61,22.99 27.81,22.99 v27.79,23.01
VDD  (via drill 0.36)  (4 unrouted)
  Top 0.305: 39.02,32.92 v39.94,32.92 40.46,33.44 R11.1 | R12.5 R12.6 R12.7 R12.8 | IC1.34 32.15,30.46 31.65,29.96 | IC1.33 31.65,29.96 | 31.65,29.96 28.14,29.96 26.65,31.45 25.21,31.45 IC1.1 | 35.44,18.37 R20.2 35.44,18.28 38.48,15.24 39.37,15.24 | 24.6,31.46 IC1.1 | C11.6 26.65,34.89 26.65,33.66 25.91,33.66 v25.78,33.78 | IC1.1 25.33,31.59 25.33,33.33 25.94,33.94 C11.5 | IC1.1 23.89,31.46 23.74,31.32 22.23,31.32 21.84,31.71 21.84,32.39 20.36,33.87 C16.1 | IC2.7 18.16,19.13 17.94,19.35 17.9,19.35 16.93,20.32 R16.2 17.14,20.95 v18.41,22.23 | IC2.14 18.16,15.16 18.72,14.61 v19.05,14.61 19.68,14.61 20.64,13.65 C13.1 | L1.2 23.5,14.61 | 49.53,27.94 49.82,27.94
  Top 0.762: J1.2 49.53,27.94 | J6.2 49.82,27.94
  Top 0.813: v39.37,20.32 39.37,15.24 39.37,13.97 36.83,11.43 26.67,11.43 23.5,14.61
  Bottom 0.305: 47.72,27.85 J1.2 42.65,32.91 40.46,32.91 40.45,32.92 v39.94,32.92 36.51,32.92 34.96,34.47 26.59,34.47 25.91,33.78 v25.78,33.78 | v18.41,22.23 21.59,19.05 21.59,15.24 20.95,14.61 v19.05,14.61
  Bottom 0.813: v39.37,20.32 46.99,27.94 J1.2
  pour Top (isolate 0.254, no thermals): 20.07,13.97 21.21,13.97 21.59,14.35 21.59,15.88 25.65,15.88 25.65,11.94 20.07,11.94
VDD18  (2 unrouted)
  Top 0.305: 29.15,34.17 IC1.43 | IC1.42 29.65,34.17 29.15,34.17 | 29.15,34.17 27.81,34.17 27.54,34.44 | 27.45,34.94 27.45,35.49 27.15,35.79 24.78,35.79 C14.2
VIN1
  Top 0.305: IC2.10 15.62,17.39 15.24,17.78 14.69,17.78 | IC2.13 17.66,15.39 17.51,15.24 16.55,15.24 C15.1
  Top 1.016: D1.C 25.34,8.73 C12.+ 18.12,8.73 14.93,11.93 14.36,11.93 13.2,13.09 13.2,16.84 13.54,17.18 C15.1
  pour Top (no thermals): 13.97,17.78 15.37,17.78 15.37,17.14 15.62,16.89 17.78,16.89 17.78,16.38 17.02,16.38 16.76,16.13 12.83,16.13 12.83,17.4 12.95,17.53 13.21,17.78 13.84,17.78
VREF
  Top 0.305: IC1.11 24.31,26.46 23.51,25.66 23.51,24.36 C10.1 C9.1
WARN  (via drill 0.36)
  Top 0.305: IC1.29 32.1,27.96 32.09,27.95 32.09,27.88 31.71,27.51 31.65,27.51 v31.45,27.31 | J6.9 J1.9
  Bottom 0.305: J1.9 46.76,10.16 31.72,25.2 31.72,27.04 v31.45,27.31
ZX0
  Top 0.305: IC1.22 31.15,23.37 32.42,22.1 39.1,22.1 40.66,20.55 40.66,13.04 34.19,6.58 30.35,6.58 29.88,7.05 20.64,7.05 17.78,4.19 J3.3
ZX1
  Top 0.305: IC1.23 31.65,23.67 32.72,22.61 39.24,22.61 41.11,20.73 41.11,12.85 34.38,6.12 30.16,6.12 29.69,6.59 22.66,6.59 20.32,4.25 J3.2
ZX2
  Top 0.305: IC1.24 32.15,24 33.03,23.11 39.39,23.11 41.57,20.94 41.57,12.66 34.57,5.66 29.97,5.66 29.5,6.13 24.7,6.13 22.86,4.29 J3.1

### Text on the board
tPlace: - / 1 | 3 / - | + | + | + | + | + | + | + | 9-12 / VAC | + | + | Energy Pulse | Zero / Crossing | VC+
bPlace: If your CT sensor has a burden / resistor built in, sever JP1 to / disable 12ohm burden resistor / for CT1 | Sever JP2 to disable 12ohm / burden resistor for CT2 | Sever JP3 to use VC+ as secondary / voltage measurement input. VC+ should / be hooked up to a second AC transformer / on a seperate circuit. / DO NOT connect both without severing / this connection first! | VC+
tNames: CircuitSetup.us Split Single / Phase Energy Meter v1.4 rev. 1 | GND | 3V3 / OUT | MOSI | MISO | CLK | CS | IRQ1 | IRQ0 | WARN | CF4 | CF3 | CF2 | CF1 | ZX0 | ZX1 | ZX2 | GND
bNames: NOTE: A 9 to 12V AC to AC transformer is required to / measure voltage and power this board. Do NOT input / more than 12VAC / / For detailed documentation, please visit CircuitSetup.us | GND | 3V3 / OUT | MOSI | MISO | SCLK | CS | CF1: Active energy pulse output / CF2: Reactive/apparent energy pulse output / CF3: Active fundamental energy pulse output / CF4: Active harmonic energy pulse output | IRQ1 | ZX2/ZX1/ZX0: / Zero-Crossing Output | IRQ0 | WARN | CF4 | CF3 | CF2 | CF1 | ZX0 | ZX1 | ZX2 | GND